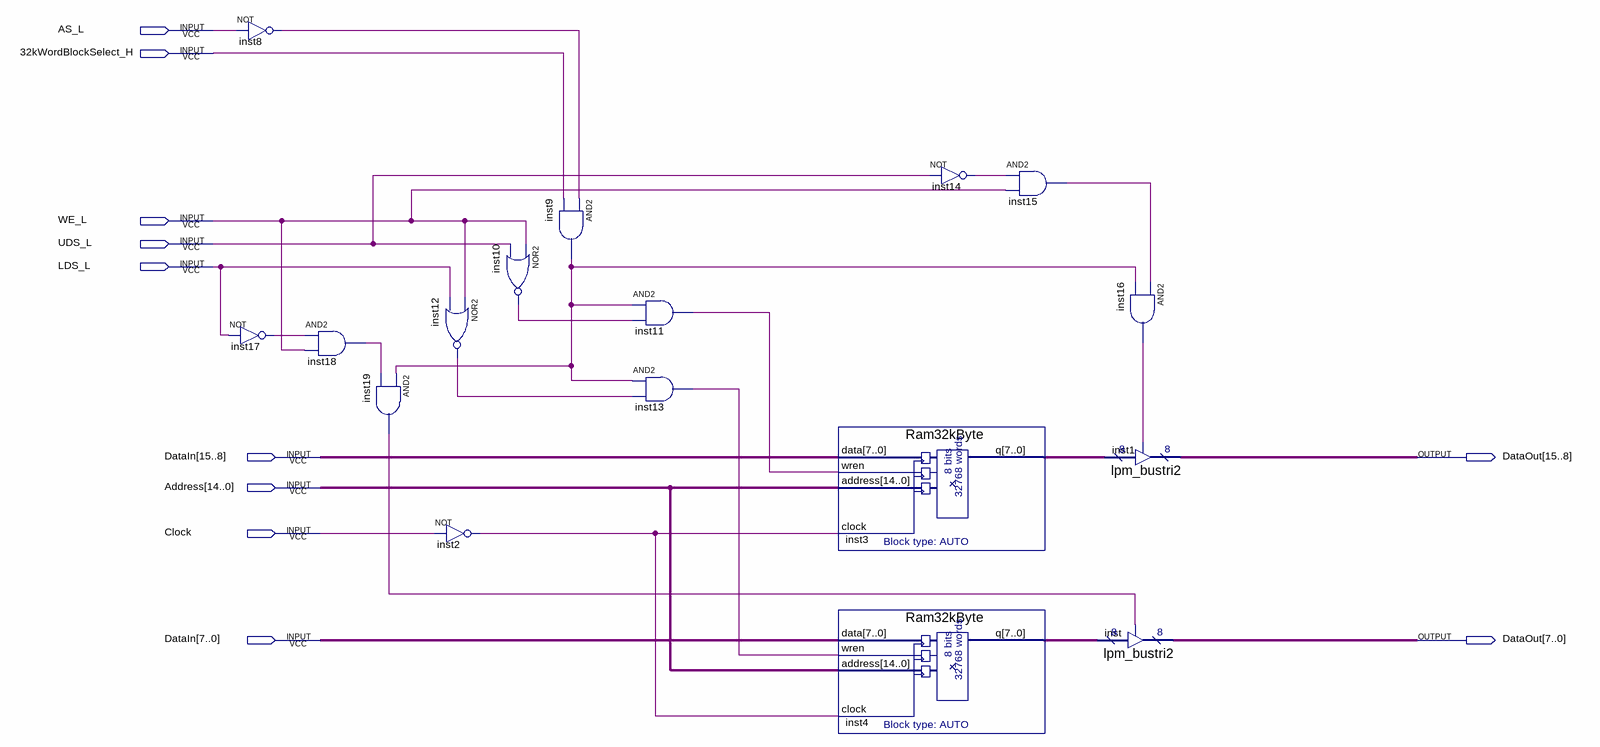
[diagram p0: schematic sheet]
// Quartus schematic SramBlock_32KWord.bdf as structural Verilog: 17 symbols, 11 pins
module SramBlock_32KWord (
  input  AS_L,
  input  \32kWordBlockSelect_H ,
  input  WE_L,
  input  UDS_L,
  input  LDS_L,
  input  [15:0] DataIn,
  input  [14:0] Address,
  input  Clock,
  output [15:0] DataOut
);

  wire inst2_out, inst8_out, inst9_out, inst10_out, inst11_out, inst12_out, inst13_out, inst14_out,
       inst15_out, inst16_out, inst17_out, inst18_out, inst19_out;
  wire [7:0] inst3_q, inst4_q;

  not inst8 (inst8_out, AS_L);
  not inst17 (inst17_out, LDS_L);
  and inst18 (inst18_out, inst17_out, WE_L);
  and inst19 (inst19_out, inst9_out, inst18_out);
  nor inst12 (inst12_out, WE_L, LDS_L);
  not inst2 (inst2_out, Clock);
  nor inst10 (inst10_out, WE_L, UDS_L);
  and inst9 (inst9_out, inst8_out, \32kWordBlockSelect_H );
  and inst11 (inst11_out, inst9_out, inst10_out);
  and inst13 (inst13_out, inst9_out, inst12_out);
  Ram32kByte inst3 (.data(DataIn[15:8]), .wren(inst11_out), .address(Address), .clock(inst2_out), .q(inst3_q));
  Ram32kByte inst4 (.data(DataIn[7:0]), .wren(inst13_out), .address(Address), .clock(inst2_out), .q(inst4_q));
  not inst14 (inst14_out, UDS_L);
  and inst15 (inst15_out, inst14_out, WE_L);
  lpm_bustri2 inst1 (.enabledt(inst16_out), .data(inst3_q), .tridata(DataOut[15:8]));
  lpm_bustri2 inst (.enabledt(inst19_out), .data(inst4_q), .tridata(DataOut[7:0]));
  and inst16 (inst16_out, inst15_out, inst9_out);
endmodule
